# EAGLE schematic TrollFace (EAGLE 8.6.1)
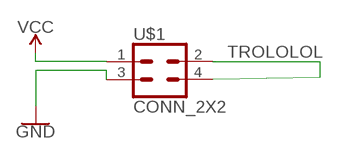
[diagram p0: schematic, sheet 1]

## Parts
U$1  CONN_2X2  [2X2_SMD]

## Nets
GND: U$1.3
TROLOLOL: U$1.2 U$1.4
VCC: U$1.1

## Library data of the parts
U$1 = SparkFun-Connectors:CONN_2X2